# EAGLE board MotherForSmoothie_preliminary (EAGLE 6.6.0), part 1 of 2
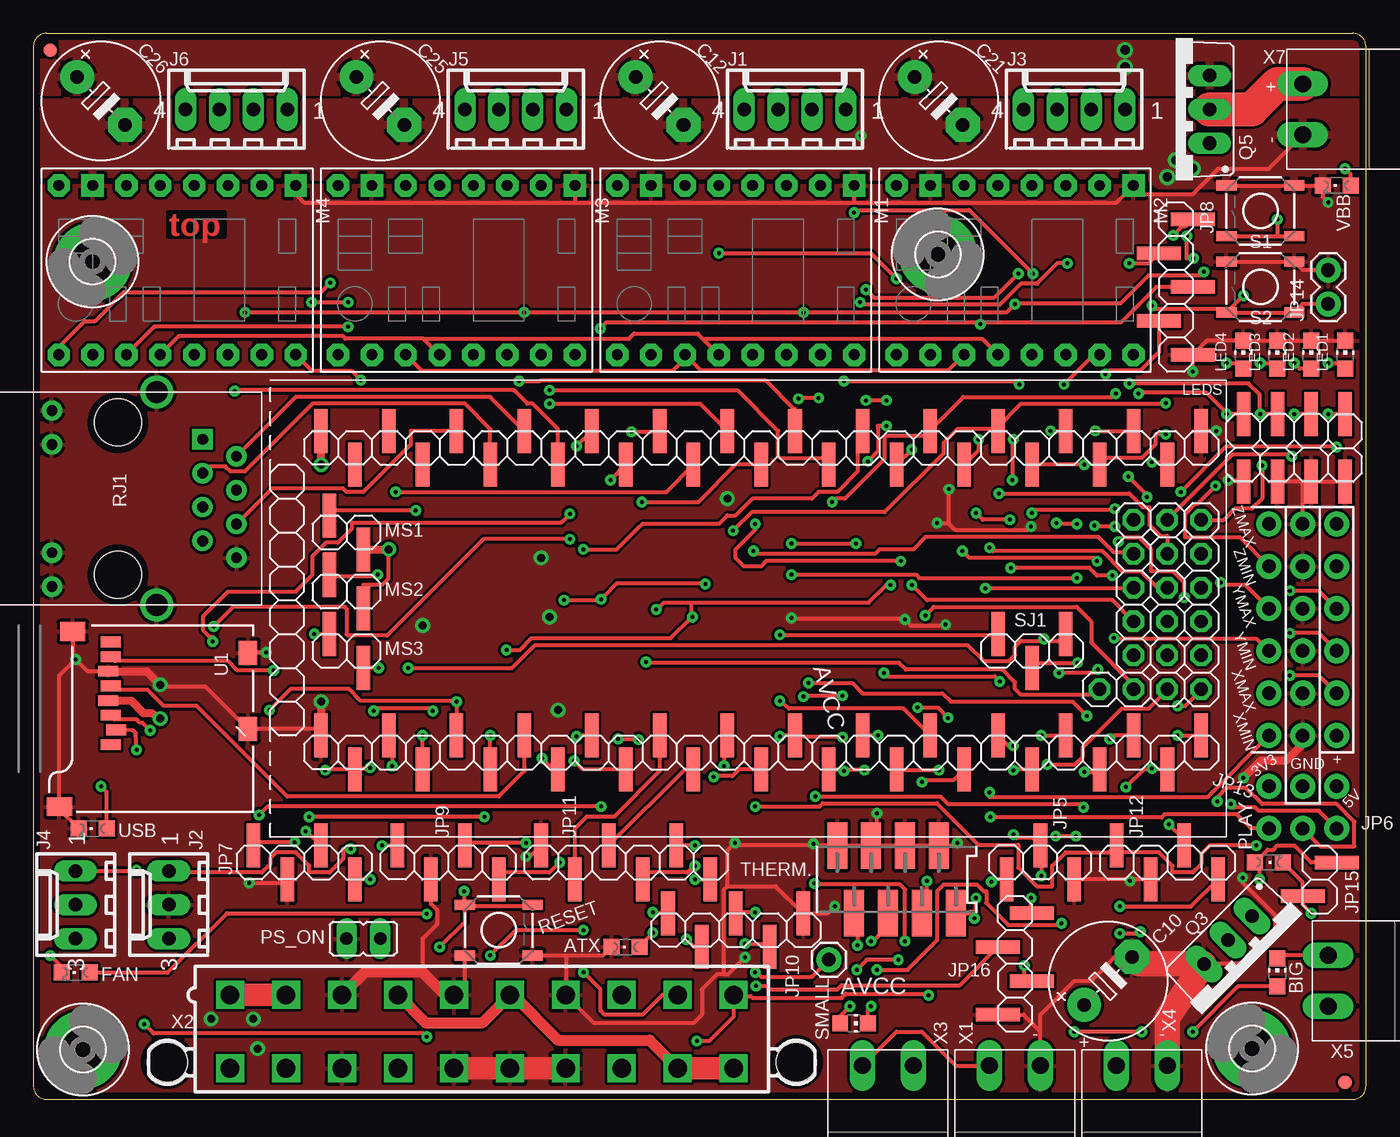
[diagram p2: board, top side]
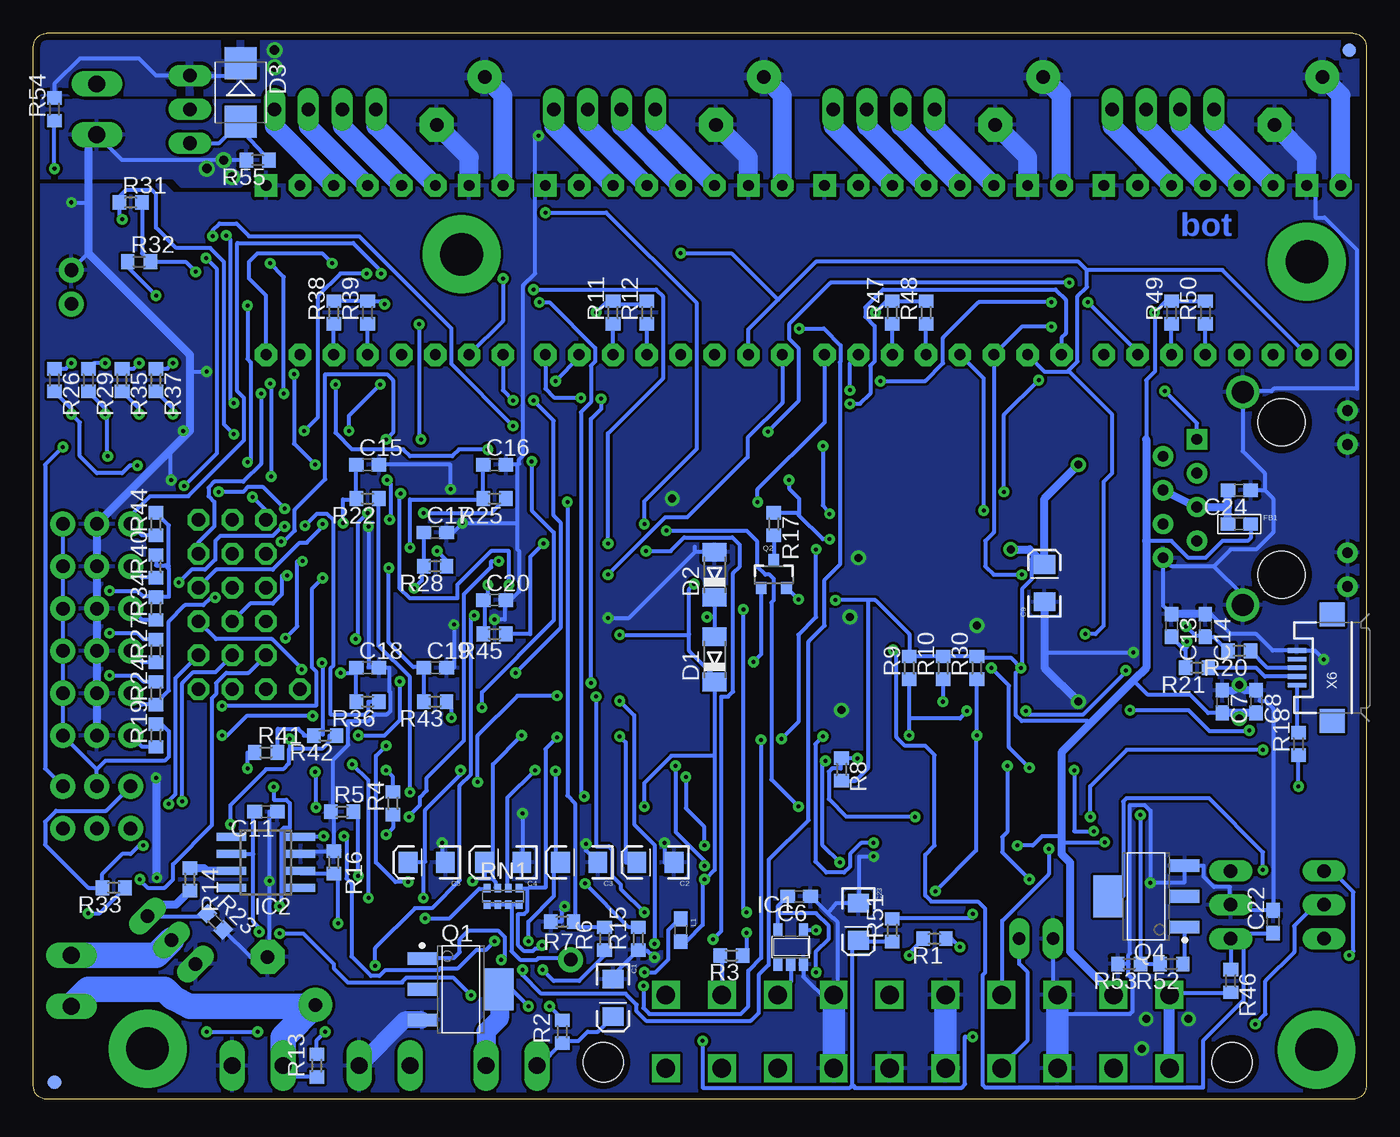
[diagram p3: board, bottom side, seen from below]

Size 100 x 80 mm. Coordinates in mm from the lower left corner, seen from the top.
Outline: 1,80 arc90 0,79 0,1 arc90 1,0 99,0 arc90 100,1 100,79 arc90 99,80 1,80
Copper layers (1*16): Top 0.035mm / dielectric 1.5mm / Bottom 0.035mm
Design rules "Leiton mit Sparkfun": minimum track width 12mil, minimum drill 0.3mm, track to track 8mil, track to pad 8mil, pad to pad 8mil, via to via 8mil, smd to smd 6mil, copper to edge 20mil, drill to drill 10mil, minimum pad ring 12mil, minimum via ring 10mil, stop-mask expansion 4mil, vias tented up to drill 25mil, thermal gap 10mil
Net classes: 1 StepCur: width 1.2 mm, drill 0.6 mm; 2 11A: width 3.5 mm, drill 2 mm

## Footprints (pad centres in the part's own frame; a part is rotated, then mirrored left to right if it is on the bottom)
CHIPLED_0805 = smd 1.2 x 1.2: A 0,-1.05; C 0,1.05
1X01 = drill 1.016 pad 1.88: 1 0,0
CHIP-LED0805 = smd 1.2 x 1.2: A 0,-1.05; C 0,1.05
EIA3216 = smd 1.4 x 1.6: A 1.4,0; C -1.4,0
C0603 = smd 1.1 x 1: 1 -0.85,0; 2 0.85,0
E5-8,5 = drill 1.016 pad 2.54: + -2.54,0 | drill 1.016 pad 2.54 octagon: - 2.54,0
MINIMELF = smd 1.4 x 1.8: A 1.7,0; C -1.7,0
SMB = smd 2.4 x 2.4: A 2.2,0; C -2.2,0
0603 = smd 1.1 x 1: 1 -0.85,0; 2 0.85,0
3,2-PAD = drill 3.2 pad 5.842: B3,2 0,0
SOT23-5 = smd 0.69 x 0.99: 1 -0.95,-1.29; 2 0,-1.29; 3 0.95,-1.29; 4 0.95,1.3; 5 -0.95,1.3
SOIC8 = smd 0.6 x 2.2: 1 -1.905,-2.6; 2 -0.635,-2.6; 3 0.635,-2.6; 4 1.905,-2.6; 5 1.905,2.6; 6 0.635,2.6; 7 -0.635,2.6; 8 -1.905,2.6
6410-04 = drill 1.016 long: 1 3.81,0; 2 1.27,0; 3 -1.27,0; 4 -3.81,0
6410-03 = drill 1.016 long: 1 2.54,0; 2 0,0; 3 -2.54,0
FIDUCIAL-1X2 = smd 1 x 1: 1 0,0
1X03SMD = smd 1.016 x 3.302: 1 -1.27,1.27; 2 1.27,-1.27; 3 3.81,1.27
1X03_NO_SILK = drill 1.016 pad 1.88: 1 0,0; 2 2.54,0; 3 5.08,0
1X04SMD = smd 1.016 x 3.302: 1 -1.27,1.27; 2 1.27,-1.27; 3 3.81,1.27; 4 6.35,-1.27
1X05SMD = smd 1.016 x 3.302: 1 -1.27,1.27; 2 1.27,-1.27; 3 3.81,1.27; 4 6.35,-1.27; 5 8.89,1.27
1X06SMD = smd 1.016 x 3.302: 1 -1.27,1.27; 2 1.27,-1.27; 3 3.81,1.27; 4 6.35,-1.27; 5 8.89,1.27; 6 11.43,-1.27
1X02 = drill 1.016 pad 1.88: 1 0,0; 2 2.54,0
1X02SMD = smd 1.016 x 3.302: 1 -1.27,1.27; 2 1.27,-1.27
2X04SMD = smd 1.016 x 3.302: 1 -1.27,-3.81; 2 -1.27,1.27; 3 1.27,-3.81; 4 1.27,1.27; 5 3.81,-3.81; 6 3.81,1.27; 7 6.35,-3.81; 8 6.35,1.27
LPCXPRESSO_LPC1769_SMD = smd 1.016 x 3.302: 1 33.655,-4.445; 2 36.195,-6.985; 3 38.735,-4.445; 4 41.275,-6.985; 5 43.815,-4.445; 6 46.355,-6.985; 7 48.895,-4.445; 8 51.435,-6.985; 9 53.975,-4.445; 10 56.515,-6.985; 11 59.055,-4.445; 12 61.595,-6.985; 13 64.135,-4.445; 14 66.675,-6.985; 15 69.215,-4.445; 16 71.755,-6.985; 17 74.295,-4.445; 18 76.835,-6.985; 19 79.375,-4.445; 20 81.915,-6.985; 21 84.455,-4.445; 22 86.995,-6.985; 23 89.535,-4.445; 24 92.075,-6.985; 25 94.615,-4.445; 26 97.155,-6.985; 27 99.695,-4.445; 28 33.655,18.415; 29 36.195,15.875; 30 38.735,18.415; 31 41.275,15.875; 32 43.815,18.415; 33 46.355,15.875; 34 48.895,18.415; 35 51.435,15.875; 36 53.975,18.415; 37 56.515,15.875; 38 59.055,18.415; 39 61.595,15.875; 40 64.135,18.415; 41 66.675,15.875; 42 69.215,18.415; 43 71.755,15.875; 44 74.295,18.415; 45 76.835,15.875; 46 79.375,18.415; 47 81.915,15.875; 48 84.455,18.415; 49 86.995,15.875; 50 89.535,18.415; 51 92.075,15.875; 52 94.615,18.415; 53 97.155,15.875; 54 99.695,18.415 | drill 1 octagon: 55 92.075,-0.965; 56 94.615,-0.965; 57 97.155,-0.965; 58 99.695,-0.965; 59 94.615,1.575; 60 97.155,1.575; 61 99.695,1.575; 62 94.615,4.115; 63 97.155,4.115; 64 99.695,4.115; 65 94.615,6.655; 66 97.155,6.655; 67 99.695,6.655; 68 94.615,9.195; 69 97.155,9.195; 70 99.695,9.195; 71 94.615,11.735; 72 97.155,11.735; 73 99.695,11.735
DRV8825 = drill 0.813 pad 1.676 square: 1 -6.35,8.89; 7 -6.35,-6.35 | drill 0.813 pad 1.676 octagon: 2 -6.35,6.35; 3 -6.35,3.81; 4 -6.35,1.27; 5 -6.35,-1.27; 6 -6.35,-3.81; 8 -6.35,-8.89; 9 6.35,-8.89; 10 6.35,-6.35; 11 6.35,-3.81; 12 6.35,-1.27; 13 6.35,1.27; 14 6.35,3.81; 15 6.35,6.35; 16 6.35,8.89
JP1 = drill 0.914 long: 1 0,-1.27; 2 0,1.27
SOT230P700X160-4N = smd 2.15 x 0.95: 1 -2.9,2.3; 2 -2.9,0; 3 -2.9,-2.3 | smd 2.15 x 3.15: 4 2.9,0
SOT23-3 = smd 0.8 x 0.9: 1 -0.95,-1; 2 0.95,-1; 3 0,1.1
TO220BV = drill 1.016 long: D 0,-2.54; G -2.54,-2.54; S 2.54,-2.54
R0603 = smd 1 x 1.1: 1 -0.85,0; 2 0.85,0
TACTILE_SWITCH_SMD = smd 1.524 x 0.762: 1 -2.54,1.905; 2 2.54,1.905; 3 -2.54,-1.905; 4 2.54,-1.905
HR911105A = drill 0.813 pad 1.524: G+ 4.953,-6.604; G- 4.953,-4.064; GND -8.89,4.445; NC -6.35,3.175; P4 -8.89,-0.635; P5 -6.35,0.635; RD+ -6.35,-1.905; RD- -8.89,1.905; TD- -8.89,-3.175; Y+ 4.953,6.604; Y- 4.953,4.064 | drill 1.651 pad 2.159: SHIELD0 -2.921,8.001; SHIELD1 -2.921,-8.001 | drill 0.813 pad 1.524 square: TD+ -6.35,-4.445 | hole 3.556: 0,-5.715; 0,5.715
0603-ARV = smd 0.5 x 0.65: 1 -1.2,-0.625; 2 -0.4,-0.625; 3 0.4,-0.625; 4 1.2,-0.625; 5 1.2,0.625; 6 0.4,0.625; 7 -0.4,0.625; 8 -1.2,0.625
SMDTOP8 = smd 1.5 x 3.5: 1 -4.445,2.54; 2 -3.175,-2.54; 3 -1.905,2.54; 4 -0.635,-2.54; 5 0.635,2.54; 6 1.905,-2.54; 7 3.175,2.54; 8 4.445,-2.54
MICRO-SD-SOCKET-PP = smd 0.8 x 1.5: 1 -8.94,10.7; 2 -7.84,10.3; 3 -6.74,10.7; 4 -5.64,10.9; 5 -4.54,10.7; 6 -3.44,10.9; 7 -2.34,10.7; 8 -1.24,10.7 | smd 1.8 x 1.4: CD1 -2.05,0.4; CD2 -7.75,0.4 | smd 1.4 x 1.9: GND1 -13.6,14.55; GND3 -0.45,13.55
MC2-G = drill 1.27 long: 1 -1.905,0; 2 1.905,0
5566-20 = drill 1.4 square: 1 18.9,-2.75; 2 14.7,-2.75; 3 10.5,-2.75; 4 6.3,-2.75; 5 2.1,-2.75; 6 -2.1,-2.75; 7 -6.3,-2.75; 8 -10.5,-2.75; 9 -14.7,-2.75; 10 -18.9,-2.75; 11 18.9,2.75; 12 14.7,2.75; 13 10.5,2.75; 14 6.3,2.75; 15 2.1,2.75; 16 -2.1,2.75; 17 -6.3,2.75; 18 -10.5,2.75; 19 -14.7,2.75; 20 -18.9,2.75 | hole 3: 23.6,2.29; -23.6,2.29
USB-MICROB = smd 0.35 x 1.4: D+ 0,2.65; D- -0.65,2.65; GND 1.3,2.65; ID 0.65,2.65; VBUS -1.3,2.65 | smd 1.8 x 1.9: MT1 -4,0; MT2 4,0

## Placement (x,y rotation side)
ATX  [CHIPLED_0805]  44.45,11.43 90 top
AVCC  M01PTH  [1X01]  59.69,10.48 0 top
BIG  [CHIP-LED0805]  93.34,9.53 0 top
C1  10uF  [EIA3216]  56.52,7.62 270 bottom
C2  10uF  [EIA3216]  53.34,17.78 180 bottom
C3  10uF  [EIA3216]  59.05,17.78 180 bottom
C4  10uF  [EIA3216]  64.77,17.78 180 bottom
C5  10uF  [EIA3216]  70.48,17.78 180 bottom
C6  .1uF  [C0603]  42.55,15.24 180 bottom
C7  1uF  [C0603]  10.79,29.84 270 bottom
C8  .1uF  [C0603]  8.26,29.84 270 bottom
C9  10uF  [EIA3216]  24.13,38.73 90 bottom
C10  100uF  [E5-8,5]  80.64,8.89 45 top
C11  .1uF  [C0603]  82.55,21.59 180 bottom
C12  100uF  [E5-8,5]  46.99,74.93 315 top
C13  18pF  [C0603]  14.61,35.56 270 bottom
C14  18pF  [C0603]  12.06,35.56 270 bottom
C15  .1uF  [C0603]  74.93,47.62 0 bottom
C16  .1uF  [C0603]  65.41,47.62 0 bottom
C17  .1uF  [C0603]  69.85,42.55 0 bottom
C18  .1uF  [C0603]  74.93,32.38 0 bottom
C19  .1uF  [C0603]  69.85,32.38 0 bottom
C20  .1uF  [C0603]  65.41,37.47 0 bottom
C21  100uF  [E5-8,5]  67.94,74.93 315 top
C22  100n  [C0603]  6.99,13.34 90 bottom
C23  10uF  [EIA3216]  38.1,13.34 270 bottom
C24  100n  [C0603]  9.53,45.72 180 bottom
C25  100uF  [E5-8,5]  26.04,74.93 315 top
C26  100uF  [E5-8,5]  5.08,74.93 315 top
D1  1N4148  [MINIMELF]  48.9,33.02 90 bottom
D2  1N4148  [MINIMELF]  48.9,39.37 90 bottom
D3  15v  [SMB]  84.45,75.56 270 bottom
FAN  [CHIPLED_0805]  3.17,9.53 90 top
FB1  [0603]  9.53,43.18 0 bottom
H1  MOUNT-PAD-ROUND3.2  [3,2-PAD]  67.88,63.42 90 top
H2  MOUNT-PAD-ROUND3.2  [3,2-PAD]  4.45,62.87 0 top
H3  MOUNT-PAD-ROUND3.2  [3,2-PAD]  3.73,3.73 0 top
H4  MOUNT-PAD-ROUND3.2  [3,2-PAD]  91.44,3.81 90 top
IC1  74AHC1G07DBV  [SOT23-5]  43.18,11.43 0 bottom
IC2  TC4427  [SOIC8]  82.55,17.78 90 bottom
J1  22-27-2041-04  [6410-04]  57.15,74.3 0 top
J2  22-27-2031-03  [6410-03]  10.16,14.61 90 top
J3  22-27-2041-04  [6410-04]  78.11,74.3 0 top
J4  22-27-2031-03  [6410-03]  3.17,14.61 90 top
J5  22-27-2041-04  [6410-04]  36.2,74.3 0 top
J6  22-27-2041-04  [6410-04]  15.24,74.3 0 top
JP1  FIDUCIAL1X2  [FIDUCIAL-1X2]  98.42,1.27 0 bottom
JP2  FIDUCIAL1X2  [FIDUCIAL-1X2]  98.42,1.27 0 top
JP3  FIDUCIAL1X2  [FIDUCIAL-1X2]  1.27,78.74 0 top
JP4  FIDUCIAL1X2  [FIDUCIAL-1X2]  1.27,78.74 0 bottom
JP5  [1X03SMD]  76.83,17.78 180 top
JP6  [1X03_NO_SILK]  97.79,20.32 180 top
JP7  [1X04SMD]  17.78,17.78 0 top
JP8  [1X05SMD]  85.72,64.77 270 top
JP9  [1X04SMD]  28.57,17.78 0 top
JP10  [1X05SMD]  48.9,12.7 0 top
JP11  [1X06SMD]  39.37,17.78 0 top
JP12  [1X04SMD]  82.55,17.78 0 top
JP13  [1X03_NO_SILK]  92.71,23.5 0 top
JP14  [1X02]  97.16,59.69 90 top
JP15  [1X02SMD]  96.52,16.51 90 top
JP16  [1X04SMD]  73.66,12.7 270 top
L1  [0603]  51.44,12.7 270 bottom
LED1  [CHIP-LED0805]  98.42,55.88 0 top
LED2  [CHIP-LED0805]  95.89,55.88 0 top
LED3  [CHIP-LED0805]  93.34,55.88 0 top
LED4  [CHIP-LED0805]  90.81,55.88 0 top
LEDS  [2X04SMD]  97.16,47.62 180 top
LPC1  [LPCXPRESSO_LPC1769_SMD]  -12.06,31.75 0 top
M1  DRV8825  [DRV8825]  52.7,62.23 270 top
M2  DRV8825  [DRV8825]  73.66,62.23 270 top
M3  DRV8825  [DRV8825]  31.75,62.23 270 top
M4  DRV8825  [DRV8825]  10.79,62.23 270 top
MS1  [1X02SMD]  23.5,42.55 0 top
MS2  [1X02SMD]  23.5,38.1 0 top
MS3  [1X02SMD]  23.5,33.66 0 top
PLAY  [CHIPLED_0805]  92.71,17.78 270 top
PS_ON  [JP1]  24.77,12.06 90 top
Q1  ZXMN4A06  [SOT230P700X160-4N]  67.94,8.26 0 bottom
Q2  MOSFET-PCHANNELSMD  [SOT23-3]  44.45,39.37 0 bottom
Q3  AOT240L  [TO220BV]  91.44,10.16 225 top
Q4  ZXMN4A06  [SOT230P700X160-4N]  16.51,15.24 180 bottom
Q5  SUP90P06-09L  [TO220BV]  85.72,74.3 90 top
R1  [R0603]  32.38,12.06 180 bottom
R2  5.6K  [R0603]  60.33,5.08 90 bottom
R3  1k  [R0603]  47.62,10.79 180 bottom
R4  [R0603]  73.03,22.23 90 bottom
R5  [R0603]  76.83,21.59 0 bottom
R6  22R  [R0603]  57.15,12.06 90 bottom
R7  10k  [R0603]  60.33,13.34 180 bottom
R8  10K  [R0603]  39.37,24.77 270 bottom
R9  10K  [R0603]  34.29,32.38 90 bottom
R10  10K  [R0603]  31.75,32.38 90 bottom
R11  10K  [R0603]  56.52,59.05 90 bottom
R12  10K  [R0603]  53.98,59.05 90 bottom
R13  5.6K  [R0603]  78.74,2.54 90 bottom
R14  22R  [R0603]  88.27,16.51 270 bottom
R15  10k  [R0603]  54.61,12.06 90 bottom
R16  10k  [R0603]  77.47,17.78 270 bottom
R17  1.5K  [R0603]  44.45,43.18 270 bottom
R18  [R0603]  5.08,26.67 90 bottom
R19  1k  [R0603]  90.81,27.3 90 bottom
R20  33R  [R0603]  9.53,33.66 180 bottom
R21  33R  [R0603]  12.7,32.38 180 bottom
R22  5k6  [R0603]  74.93,45.09 180 bottom
R23  10k  [R0603]  86.36,13.34 315 bottom
R24  1k  [R0603]  90.81,30.48 90 bottom
R25  5k6  [R0603]  65.41,45.09 180 bottom
R26  1k  [R0603]  98.42,53.98 270 bottom
R27  1k  [R0603]  90.81,33.66 90 bottom
R28  5k6  [R0603]  69.85,40.01 180 bottom
R29  1k  [R0603]  95.89,53.98 270 bottom
R30  10K  [R0603]  29.21,32.38 90 bottom
R31  10K  [R0603]  92.71,67.31 0 bottom
R32  10K  [R0603]  92.08,62.87 0 bottom
R33  1k  [R0603]  93.98,15.88 180 bottom
R34  1k  [R0603]  90.81,36.83 90 bottom
R35  1k  [R0603]  93.34,53.98 270 bottom
R36  5k6  [R0603]  74.93,29.84 180 bottom
R37  1k  [R0603]  90.81,53.98 270 bottom
R38  10K  [R0603]  77.47,59.05 90 bottom
R39  10K  [R0603]  74.93,59.05 90 bottom
R40  1k  [R0603]  90.81,40.01 90 bottom
R41  2.2k  [R0603]  82.55,26.04 0 bottom
R42  2.2k  [R0603]  78.11,27.3 180 bottom
R43  5k6  [R0603]  69.85,29.84 180 bottom
R44  1k  [R0603]  90.81,43.18 90 bottom
R45  5k6  [R0603]  65.41,34.92 180 bottom
R46  ?  [R0603]  10.16,8.89 270 bottom
R47  10K  [R0603]  35.56,59.05 90 bottom
R48  10K  [R0603]  33.02,59.05 90 bottom
R49  10K  [R0603]  14.61,59.05 90 bottom
R50  10K  [R0603]  12.06,59.05 90 bottom
R51  5.6K  [R0603]  35.56,12.7 90 bottom
R52  22R  [R0603]  14.61,10.16 180 bottom
R53  10k  [R0603]  17.78,10.16 180 bottom
R54  2.2K  [R0603]  98.42,74.3 90 bottom
R55  10k  [R0603]  83.19,70.48 180 bottom
RESET  [TACTILE_SWITCH_SMD]  34.92,12.7 0 top
RJ1  HR911105A  [HR911105A]  6.35,45.09 180 top
RN1  4.7K  [0603-ARV]  64.77,15.24 180 bottom
S1  [TACTILE_SWITCH_SMD]  92.08,66.67 180 top
S2  [TACTILE_SWITCH_SMD]  92.08,60.96 180 top
SJ1  [1X03SMD]  73.66,33.66 0 top
SMALL  [CHIP-LED0805]  61.59,5.71 270 top
THERM.  [SMDTOP8]  64.77,16.51 0 top
U1  USD-SOCKETNEW  [MICRO-SD-SOCKET-PP]  16.51,35.56 90 top
USB  [CHIPLED_0805]  4.45,20.32 90 top
VBB  [CHIPLED_0805]  97.79,68.58 90 top
X1  MC2-G  [MC2-G]  73.66,2.54 0 top
X2  5566-20  [5566-20]  33.66,5.08 180 top
X3  MC2-G  [MC2-G]  64.14,2.54 0 top
X4  MC2-G  [MC2-G]  83.19,2.54 0 top
X5  MC2-G  [MC2-G]  97.16,8.89 90 top
X6  USB-MICROB  [USB-MICROB]  2.54,32.38 90 bottom
X7  MC2-G  [MC2-G]  95.25,74.3 90 top
XMAX  [1X03_NO_SILK]  92.71,30.48 0 top
XMIN  [1X03_NO_SILK]  92.71,27.3 0 top
YMAX  [1X03_NO_SILK]  92.71,36.83 0 top
YMIN  [1X03_NO_SILK]  92.71,33.66 0 top
ZMAX  [1X03_NO_SILK]  92.71,43.18 0 top
ZMIN  [1X03_NO_SILK]  92.71,40.01 0 top